# EasyEDA Pro project CT模拟器.eprj

# Schematic Schematic1
Board Name: Board1; Create Date: 2025-09-21; Page Name: P1; Project Name: 电流检测; Schematic Name: Schematic1; Update Date: 2025-09-22; Company: 嘉立创EDA; Page Size: A4; Version: V1.0
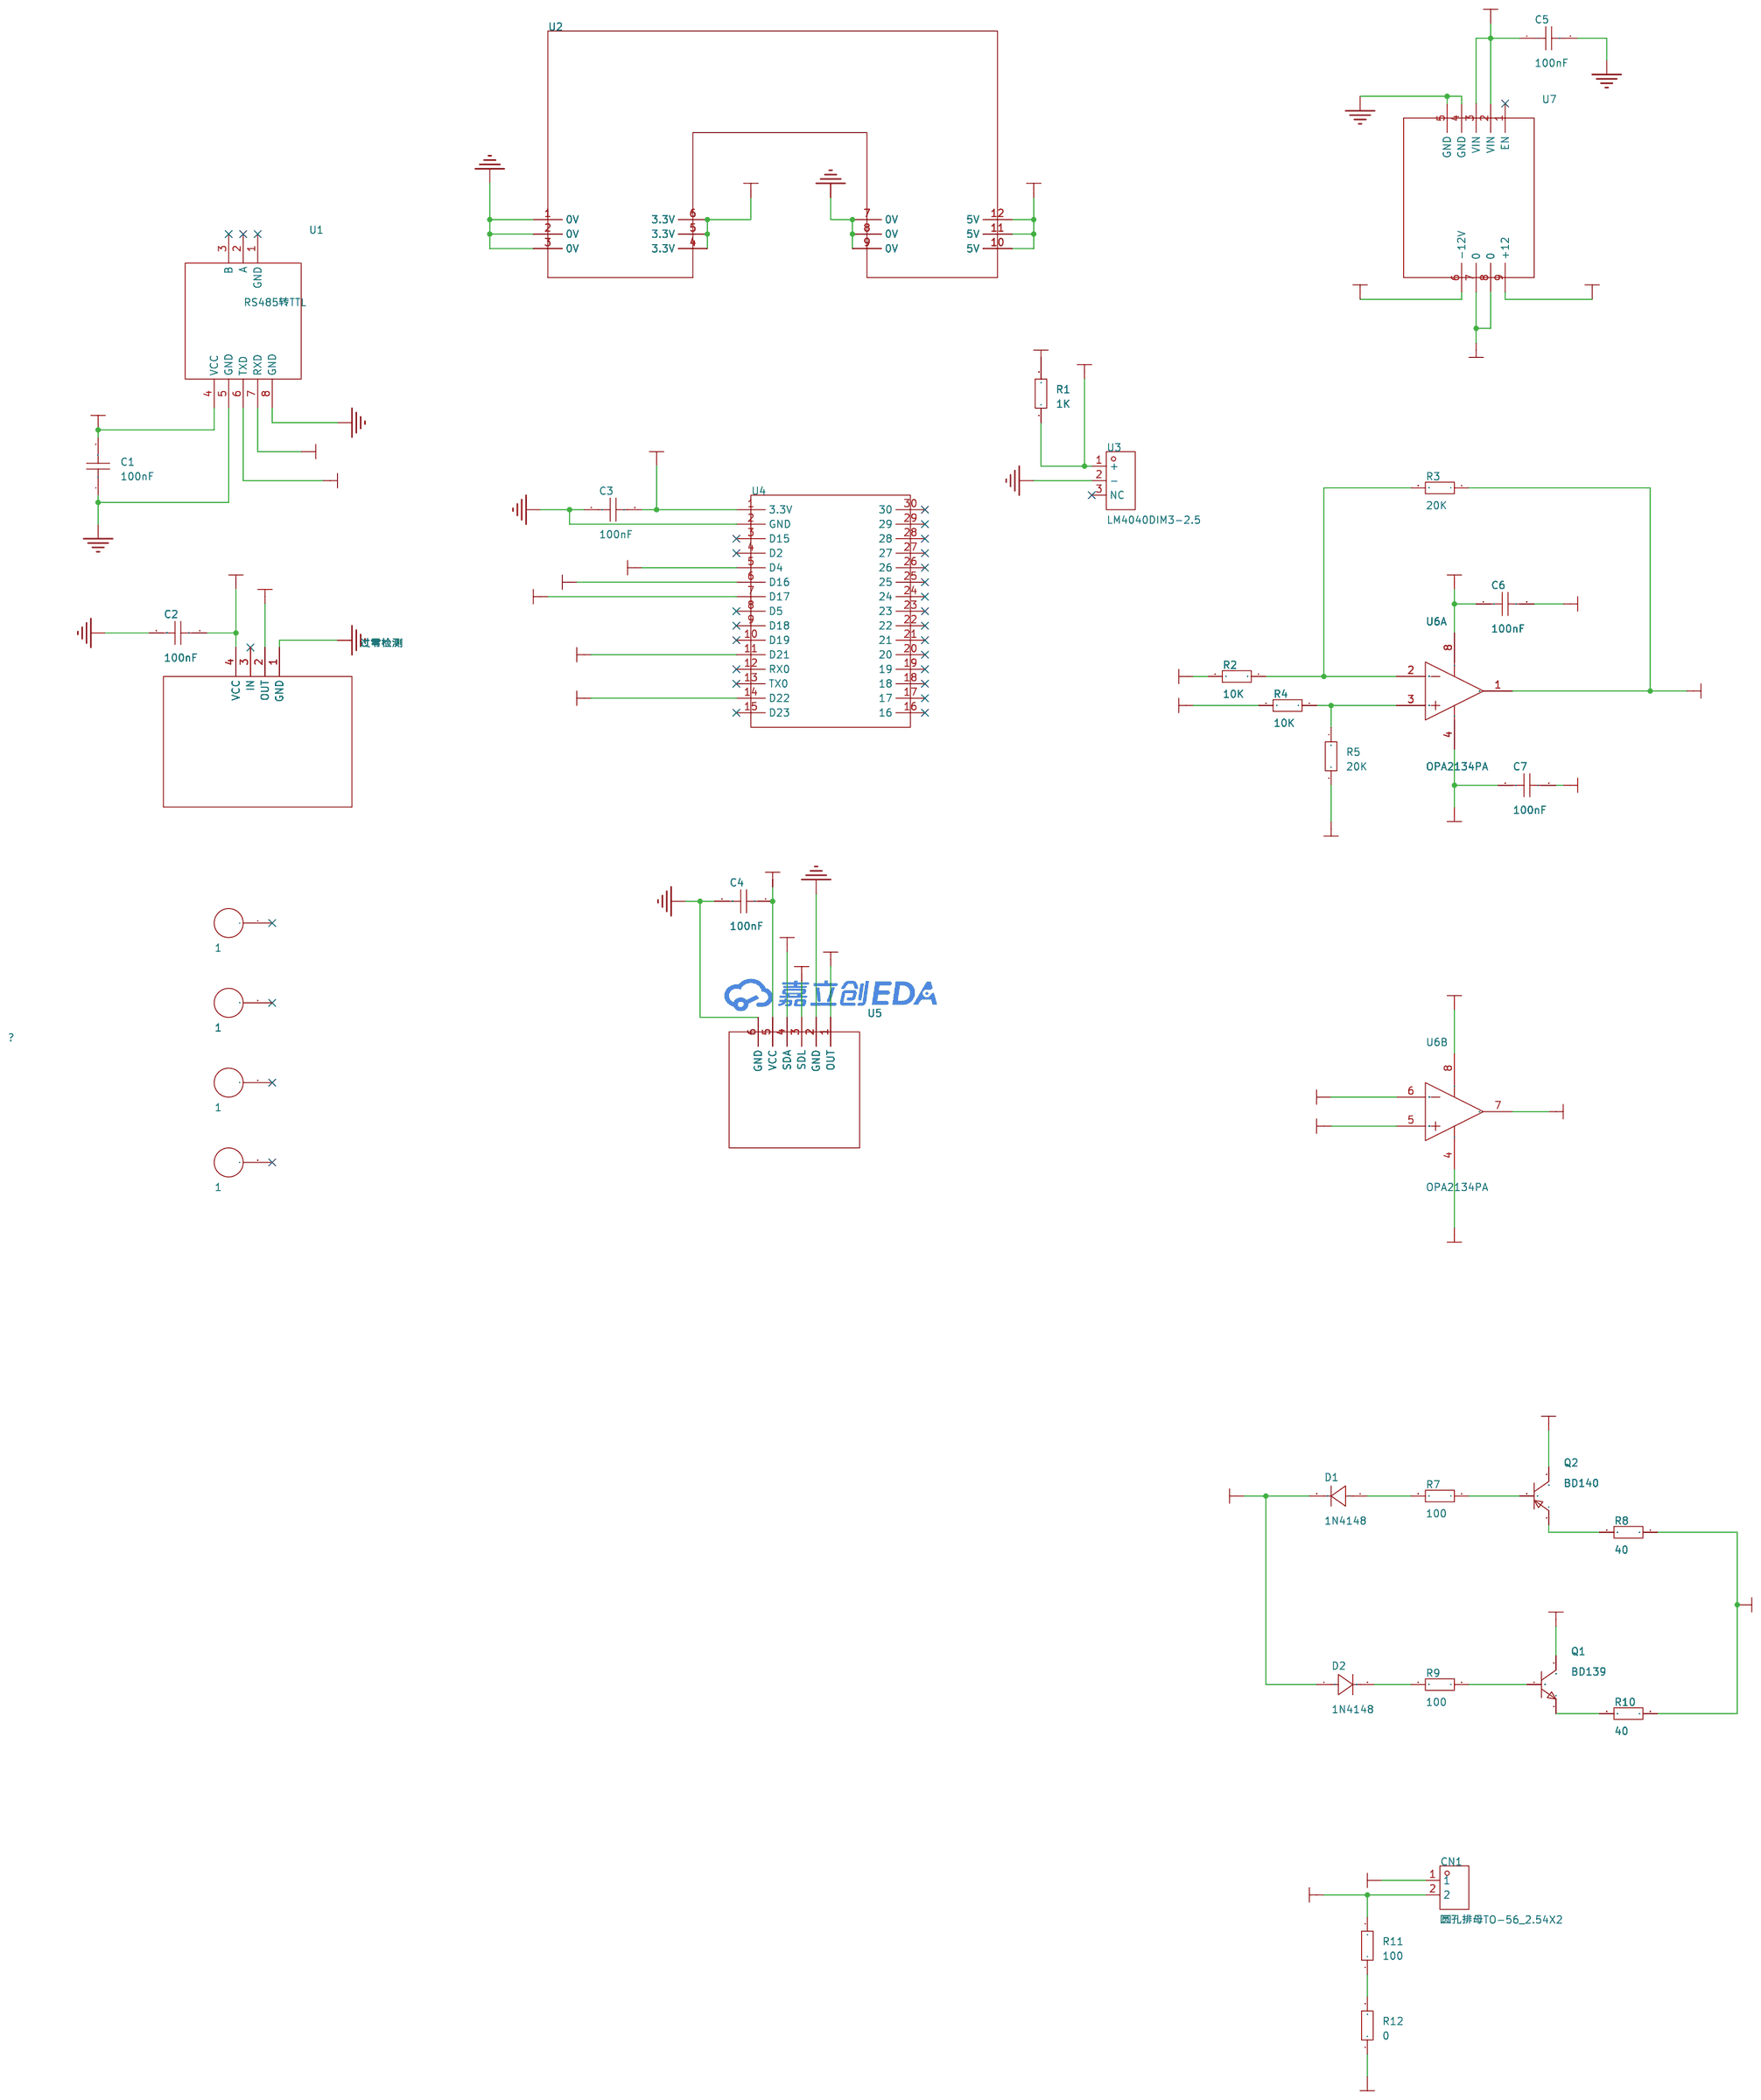
[diagram p0: schematic sheet]

## Parts
C1  100nF  [C0805]
C2  100nF  [C0805]
C3  100nF  [C0805]
C4  100nF  [C0805]
C5  100nF  [C0805]
C6  100nF  [C0805]
C7  100nF  [C0805]
CN1  圆孔排母TO-56_2.54X2  [CONN-TH_TO-56_2.54-2]
D1  1N4148  [DO-35_BD2.2-L4.0-D0.50_1N4148]
D2  1N4148  [DO-35_BD2.2-L4.0-D0.50_1N4148]
Q1  BD139  [TO-126_L7.5-W2.5-P2.3-B]
Q2  BD140  [TO-126_L8.3-W3.5-P2.29-T]
R1  1K  [R0805]
R2  10K  [R0805]
R3  20K  [R0805]
R4  10K  [R0805]
R5  20K  [R0805]
R7  100  [R0805]
R8  40  [R0805]
R9  100  [R0805]
R10  40  [R0805]
R11  100  [R0805]
R12  0  [R0805]
U1  RS485转TTL  [RS485转TTL]
U2  -  [9V1A供电]
U3  LM4040DIM3-2.5  [SOT-23-3_L2.9-W1.3-P1.90-LS2.4-BR]
U4  -  [ESP32]
U5  -  [mcp4725]
U6  OPA2134PA  [DIP-8_L9.6-W6.4-P2.54-LS7.6-BL-1]  (sections 1,2)
U7  -  [-12/+12]
V-PB2  1  [SMD_BD4.2-L4.7-W4.7-D3.0]
V-PB3  1  [SMD_BD4.2-L4.7-W4.7-D3.0]
V-PB4  1  [SMD_BD4.2-L4.7-W4.7-D3.0]
V-PB5  1  [SMD_BD4.2-L4.7-W4.7-D3.0]
过零检测  -  [过零检测]

## Library data of the parts
C1-C7 = CGA0805X6S107M4R0MT: LCSC Part Name: 100uF ±20% 4V; Supplier Part: C42371696; Manufacturer: HRE(芯声); Supplier Footprint: 0805; Datasheet: https://item.szlcsc.com/datasheet/CGA0805X6S107M4R0MT/44253246.html; Supplier: LCSC; Tolerance: ±20%; Voltage Rating: 4V; Temperature Coefficient: X6S
CN1 = 圆孔排母TO-56_2.54X2: Supplier Part: C9900002039; Supplier Footprint: TH-2_2.54X5.08X2.54P; JLCPCB Part Class: 扩展库; Supplier: LCSC
D1 D2 = 1N4148_C18195411: Supplier Part: C18195411; Manufacturer: LJ(朗捷); Supplier Footprint: DO-35; JLCPCB Part Class: 扩展库; Datasheet: https://item.szlcsc.com/datasheet/1N4148/19344798.html; Supplier: LCSC; Voltage - Forward(Vf@If): 1V@10mA; Voltage - DC Reverse(Vr): 100V; Current - Rectified: 150mA; Pd - Power Dissipation: 500mW; Reverse Leakage Current (Ir): 5mA; Reverse Recovery Time (trr): 4ns; Operating Junction Temperature Range: -60℃~+200℃; Non-Repetitive Peak Forward Surge Current: 500mA
Q1 = BD139: LCSC Part Name: NPN 电流:1.5A 电压:80V; Supplier Part: C27866; Manufacturer: ST(意法半导体); Supplier Footprint: TO-126; JLCPCB Part Class: 扩展库; Datasheet: https://item.szlcsc.com/datasheet/BD139/28616.html; Supplier: LCSC; type: NPN; Current - Collector(Ic): 1.5A; Collector - Emitter Voltage VCEO: 80V; Pd - Power Dissipation: 12.5W; DC Current Gain: 63@150mA,2V; Current - Collector Cutoff: 10uA; Vce Saturation(VCE(sat)): 500mV@0.5A,0.05A; Operating Temperature: -65℃~+150℃; Emitter-Base Voltage(Vebo): 5V; Number: 1个NPN
Q2 = BD140: LCSC Part Name: PNP 电流:1.5A 电压:80V; Supplier Part: C20604; Manufacturer: CJ(江苏长电/长晶); Supplier Footprint: TO-126; JLCPCB Part Class: 扩展库; Datasheet: https://item.szlcsc.com/datasheet/BD140/21316.html; Supplier: LCSC; type: PNP; Current - Collector(Ic): 1.5A; Collector - Emitter Voltage VCEO: 80V; Pd - Power Dissipation: 1.25W; DC Current Gain: 40@150mA,2V; Current - Collector Cutoff: 100nA; Vce Saturation(VCE(sat)): 500mV@500mA,50mA; Operating Temperature: -55℃~+150℃; Emitter-Base Voltage(Vebo): 5V; Number: 1个PNP
R1-R5 R7-R12 = 0805W8F1004T5E: LCSC Part Name: 1MΩ ±1% 125mW 厚膜电阻; Supplier Part: C17514; Manufacturer: UNI-ROYAL(厚声); Supplier Footprint: 0805; JLCPCB Part Class: 基础库; Datasheet: https://atta.szlcsc.com/upload/public/pdf/source/20200306/C422600_1E6D84923E4A46A82E41ADD87F860B5C.pdf; Supplier: LCSC; Type: 厚膜电阻; Tolerance: ±1%; Power(Watts): 125mW; Overload Voltage (Max): 150V; Temperature Coefficient: ±100ppm/℃; Operating Temperature Range: -55℃~+155℃
U1 = RS485转TTL
U2 = 9V1A供电
U3 = LM4040DIM3-2.5_C3717666: Supplier Part: C3717666; Manufacturer: TI(德州仪器); Supplier Footprint: SOT-23-3; JLCPCB Part Class: 扩展库; Datasheet: https://atta.szlcsc.com/upload/public/pdf/source/20230921/37A18546BF83911EF2A4ECD725D0B31B.pdf; Supplier: LCSC; Output Type: 固定; Output Voltage: 2.5V; Output Current: 15mA; Tolerance: ±1%; Temperature Coefficient: 150ppm/℃; Reference Type: 并联; Noise - 10Hz to 10kHz: 35uVrms; Operating Temperature: -40℃~+85℃@(Ta)
U4 = ESP32
U5 = mcp4725
U6 = OPA2134PA: Supplier Part: C1346118; Manufacturer: TI(德州仪器); Supplier Footprint: PDIP-8; JLCPCB Part Class: 扩展库; Datasheet: https://www.ti.com/cn/lit/gpn/opa2134; Supplier: LCSC; Speaker Channels: 双声道; Operating Temperature: -40℃~+85℃
U7 = -12/+12
V-PB2-V-PB5 = 铜柱M3*5+6: M3*5+6; LCSC Part Name: 国产 铜柱M3*5+6 铜柱M3*5+6; Supplier Part: C87703; Manufacturer: 国产; JLCPCB Part Class: 扩展库; Supplier: LCSC
过零检测 = 过零检测

## Nets
0V: C6.2 C7.2 R5.2 R12.1 U7.7(0) U7.8(0)
3.3V: C1.2 C2.1 C3.2 U1.4(VCC) U2.4(3.3V) U2.5(3.3V) U2.6(3.3V) U4.1(3.3V) 过零检测.4(VCC)
5V: C4.2 C5.1 R1.2 U2.10(5V) U2.11(5V) U2.12(5V) U5.5(VCC) U7.2(VIN) U7.3(VIN)
+12V: C6.1 Q1.2(C) U6.8(V+) U7.9(+12)
-12V: C7.1 Q2.2(C) U6.4(V-) U7.6(-12V)
GND: C1.1 C2.2 C3.1 C4.1 C5.2 U1.5(GND) U1.8(GND) U2.1(0V) U2.2(0V) U2.3(0V) U2.7(0V) U2.8(0V) U2.9(0V) U3.2(-) U4.2(GND) U5.2(GND) U5.6(GND) U7.4(GND) U7.5(GND) 过零检测.1(GND)
CT+: CN1.1 R8.2 R10.2
CT-: CN1.2 R11.2 U6.6(-IN B)
LM4040_2.5: R1.1 R2.2 U3.1(+)
OUT_0: U4.5(D4) 过零检测.2(OUT)
OUT_MCP4725: R4.2 U5.1(OUT)
RX: U1.7(RXD) U4.6(D16)
SDA: U4.11(D21) U5.4(SDA)
SDL: U4.14(D22) U5.3(SDL)
TX: U1.6(TXD) U4.7(D17)
VOUT1: R3.1 U6.1(OUT A) U6.5(+IN B)
VOUT2: D1.2(C) D2.1(A) U6.7(OUT B)
$1N2708: R2.1 R3.2 U6.2(-IN A)
$1N3016: R4.1 R5.1 U6.3(+IN A)
$1N3573: Q2.3(B) R7.1
$1N3578: D1.1(A) R7.2
$1N3803: D2.2(C) R9.2
$1N3806: Q1.1(B) R9.1
$1N3915: Q1.3(E) R10.1
$1N3922: Q2.1(E) R8.1
$1N11273: R11.1 R12.2

Not connected (* = marked no-connect by the designer): U1 1(GND)* 2(A)* 3(B)*; U3 3(NC)*; U4 3(D15)* 4(D2)* 8(D5)* 9(D18)* 10(D19)* 12(RX0)* 13(TX0)* 15(D23)* 16* 17* 18* 19* 20* 21* 22* 23* 24* 25* 26* 27* 28* 29* 30*; U7 1(EN)*; V-PB2 1*; V-PB3 1*; V-PB4 1*; V-PB5 1*; 过零检测 3(IN)*

# Board PCB1
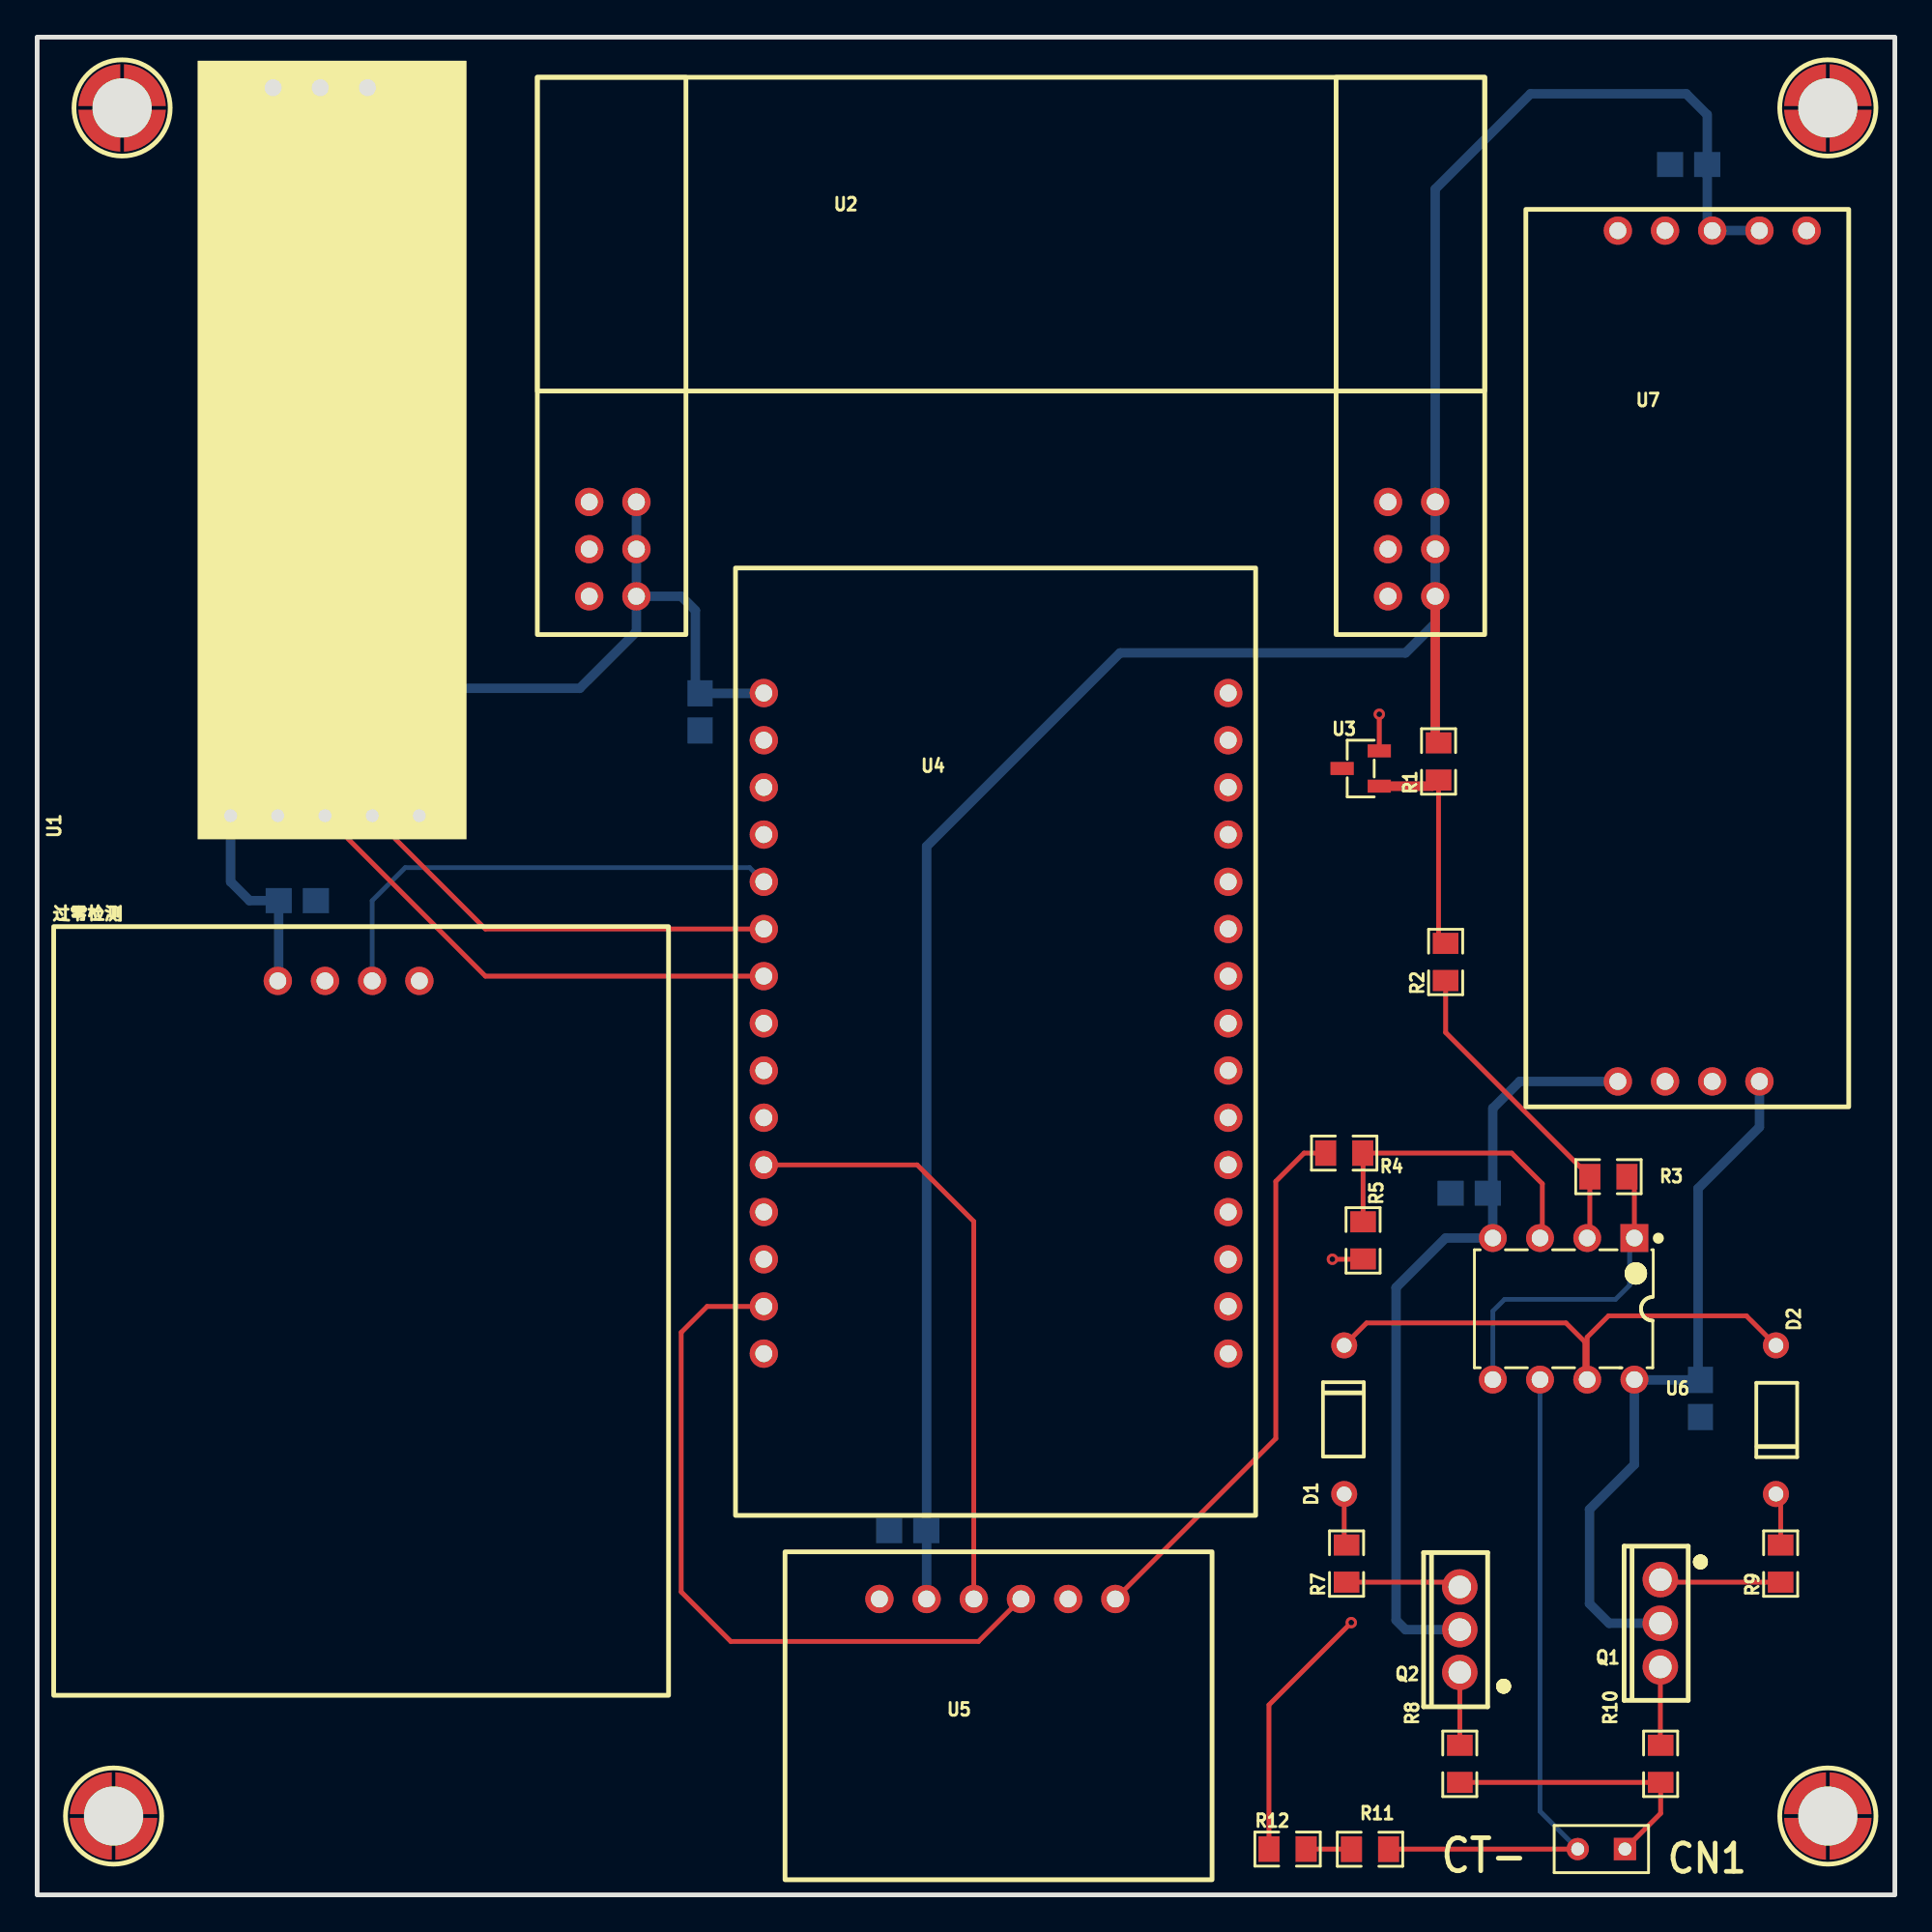
[diagram p1: board, top side]
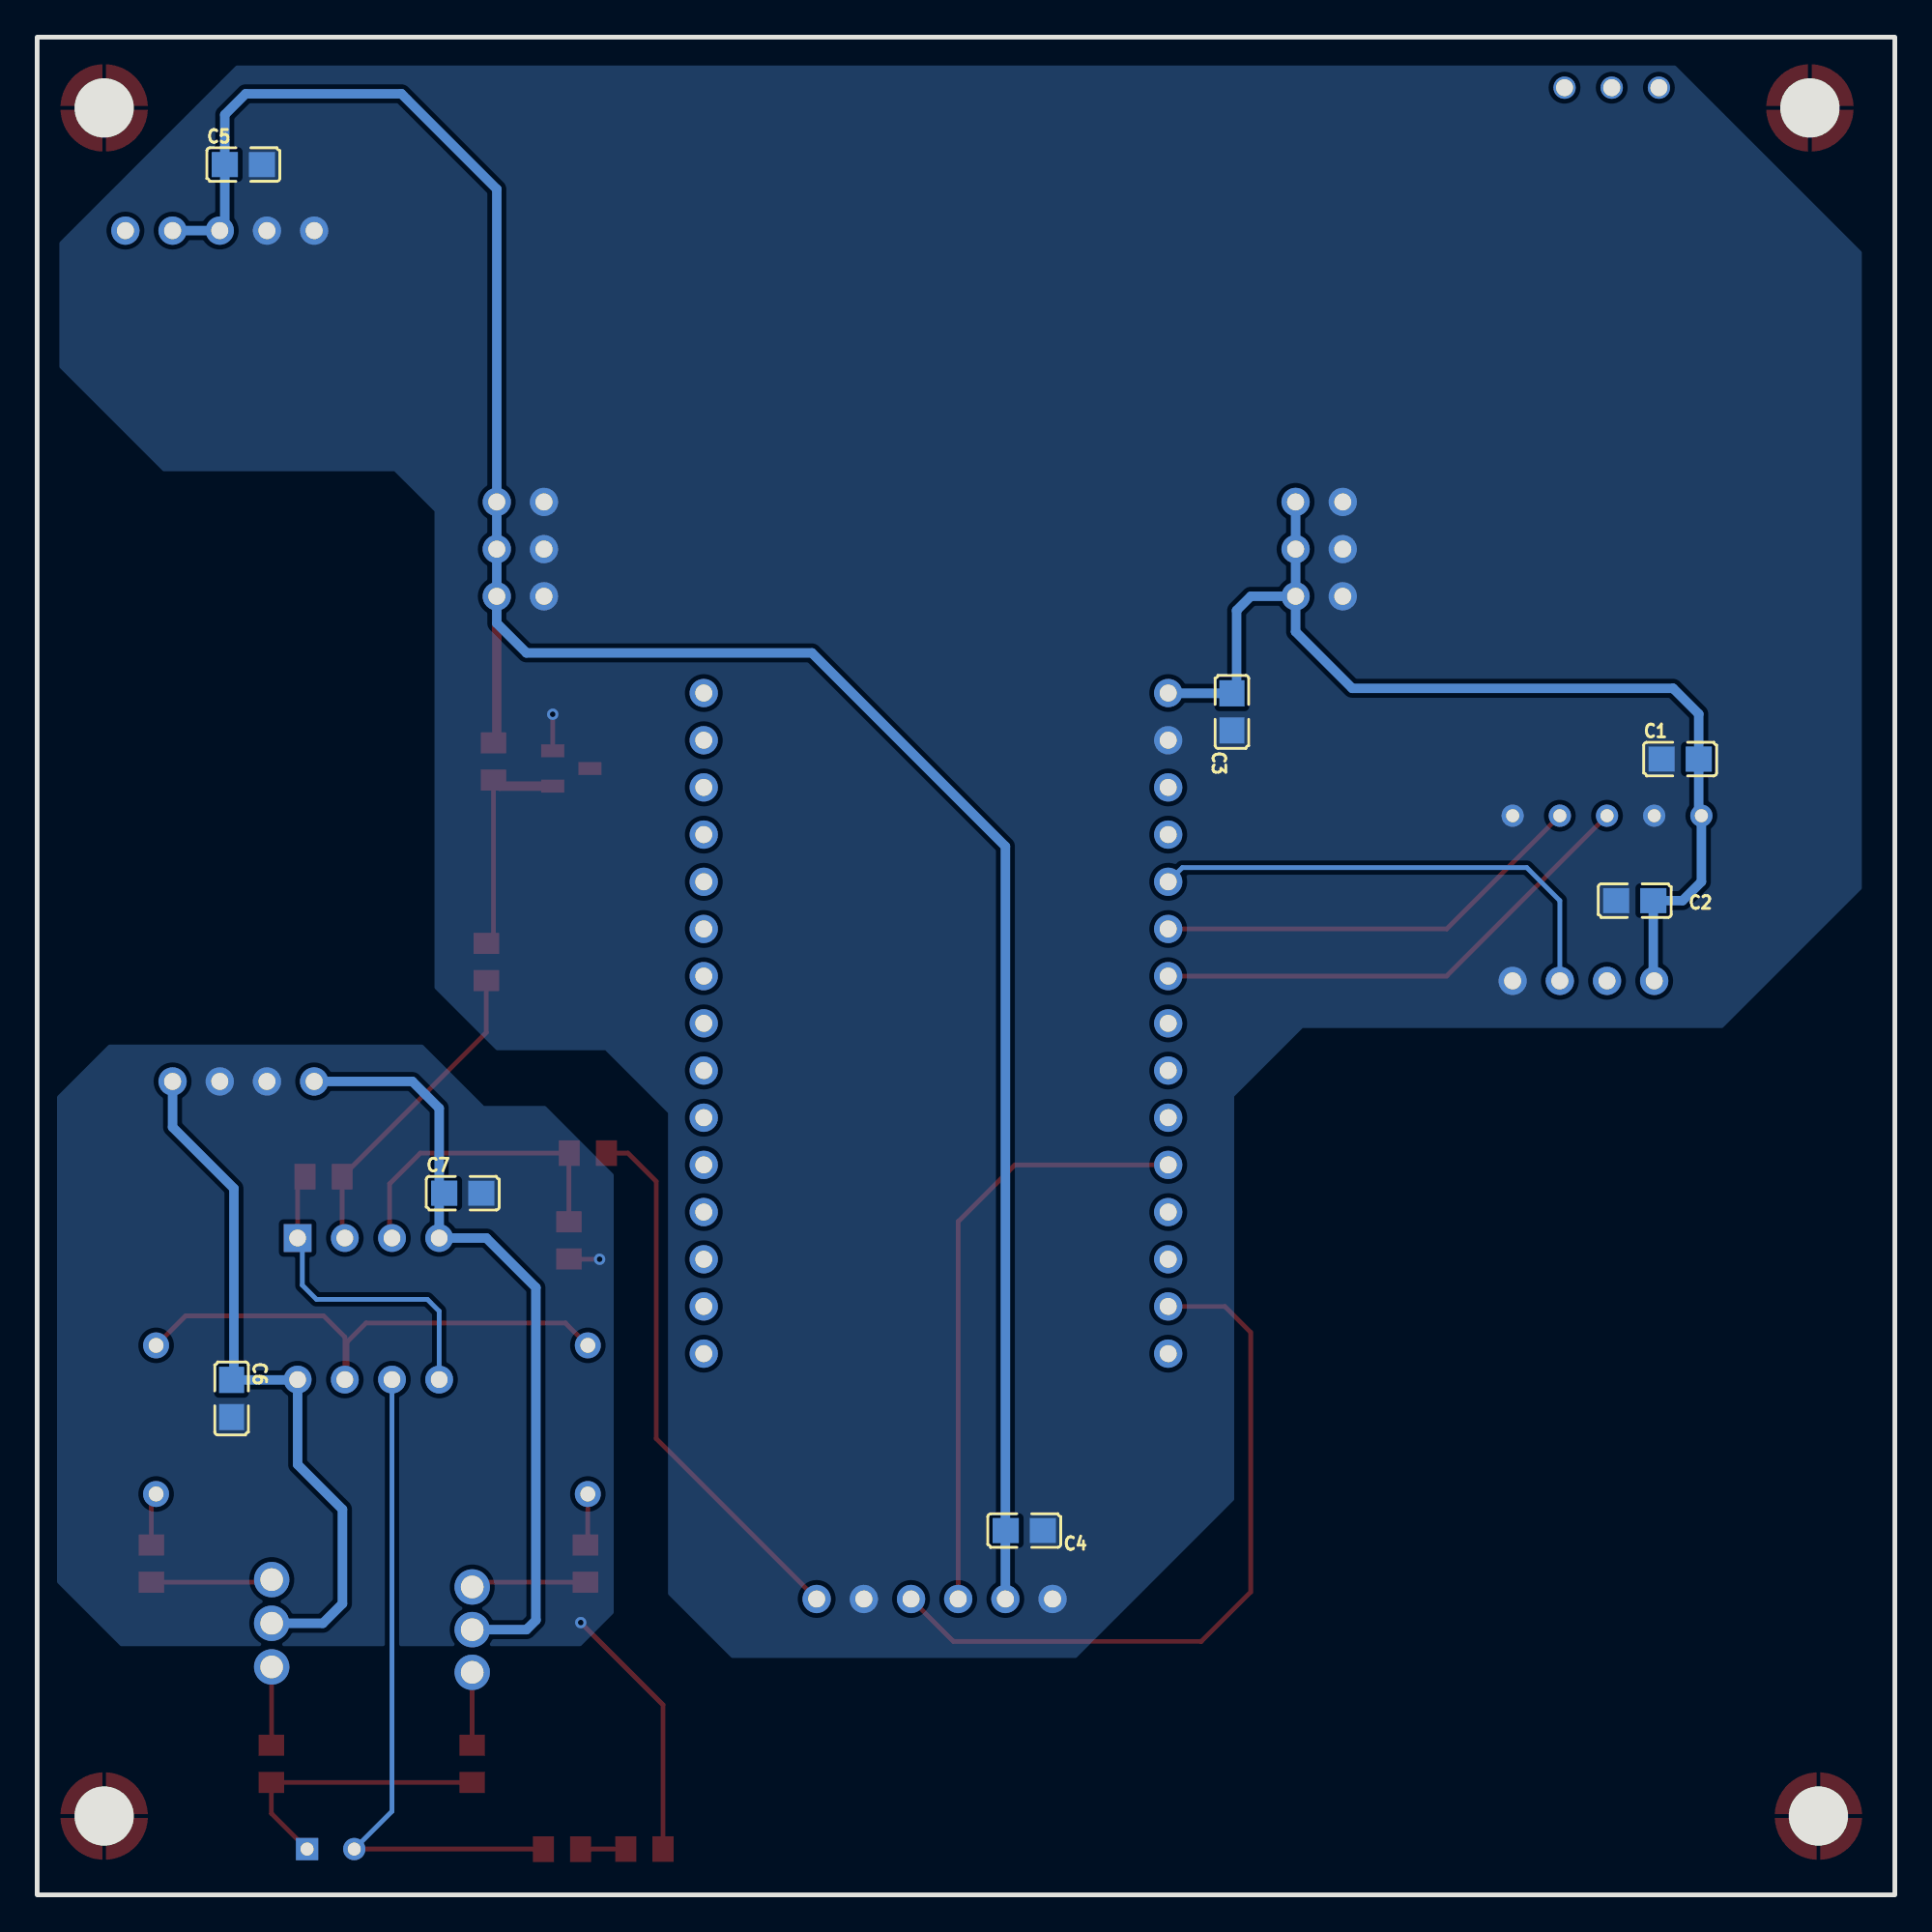
[diagram p2: board, bottom side, seen from below]

Outline 100 x 100 mm; copper layers: Top Layer, Bottom Layer. Coordinates in mm from the lower left corner of the outline.
Outline path: rectangle 0,100 100,0
Stack: Top Layer 0.035mm / Dielectric1 1.51mm FR4 er 4.5 / Bottom Layer 0.035mm

## Design rules (mm)
template: 自定义配置
spacing copperThickness1oz (default): track to track 0.102, other pairs 0.152 to 0.3
spacing copperThickness2oz: track to track 0.203, other pairs 0.152 to 0.3
track width copperThickness1oz (default): min 0.127, default 0.254, max 2.54
track width copperThickness2oz: min 0.203, default 0.254, max 2.54
differential pair differentialPair (default): width min 0.127, default 0.254, max 2.54; gap min 0.152, default 0.152
via viaSize (default): diameter min 0.5, default 0.61, max 10; hole min 0.3, default 0.305, max 6.3

## Placement (name value [footprint] x y rotation side)
C1  100nF  [C0805]  11.56 61.14 180 bottom
C2  100nF  [C0805]  14 53.52 0 bottom
C3  100nF  [C0805]  35.69 63.68 90 bottom
C4  100nF  [C0805]  46.86 19.61 0 bottom
C5  100nF  [C0805]  88.9 93.14 180 bottom
C6  100nF  [C0805]  89.53 26.72 270 bottom
C7  100nF  [C0805]  77.09 37.77 180 bottom
CN1  圆孔排母TO-56_2.54X2  [CONN-TH_TO-56_2.54-2]  84.2 2.46 180 top
D1  1N4148  [DO-35_BD2.2-L4.0-D0.50_1N4148]  70.36 25.58 90 top
D2  1N4148  [DO-35_BD2.2-L4.0-D0.50_1N4148]  93.6 25.58 270 top
Q1  BD139  [TO-126_L7.5-W2.5-P2.3-B]  87.38 14.62 180 top
Q2  BD140  [TO-126_L8.3-W3.5-P2.29-T]  76.58 14.28 180 top
R1  1K  [R0805]  75.44 61.01 90 top
R2  10K  [R0805]  75.82 50.22 90 top
R3  20K  [R0805]  84.58 38.66 180 top
R4  10K  [R0805]  70.36 39.93 180 top
R5  20K  [R0805]  71.37 35.23 270 top
R7  100  [R0805]  70.48 17.83 90 top
R8  40  [R0805]  76.58 7.05 270 top
R9  100  [R0805]  93.85 17.83 90 top
R10  40  [R0805]  87.39 7.05 270 top
R11  100  [R0805]  71.75 2.46 0 top
R12  0  [R0805]  67.31 2.46 0 top
U1  -  [RS485转TTL]  16 76.51 90 top
U2  -  [9V1A供电]  29.72 74.98 0 top
U3  LM4040DIM3-2.5  [SOT-23-3_L2.9-W1.3-P1.90-LS2.4-BR]  71.25 60.63 0 top
U4  -  [ESP32]  38.99 67.36 0 top
U5  -  [mcp4725]  42.8 15.93 0 top
U6  OPA2134PA  [DIP-8_L9.6-W6.4-P2.54-LS7.6-BL-1]  82.17 31.55 180 top
U7  -  [-12/+12]  85.09 89.59 0 top
V-PB2  1  [SMD_BD4.2-L4.7-W4.7-D3.0]  96.39 96.19 0 top
V-PB3  1  [SMD_BD4.2-L4.7-W4.7-D3.0]  4.57 96.19 0 top
V-PB4  1  [SMD_BD4.2-L4.7-W4.7-D3.0]  96.39 4.24 0 top
V-PB5  1  [SMD_BD4.2-L4.7-W4.7-D3.0]  4.11 4.24 0 top
过零检测  -  [过零检测]  12.95 49.2 0 top

## Footprints (pads in the part's own frame, mm; a bottom-side part is the same pattern mirrored in y, then rotated)
9V1A供电
  round 1.524 hole 0.914: 1(0,0) 2(0,-2.54) 3(0,-5.08) 4(2.54,-5.08) 5(2.54,-2.54) 6(2.54,0) 7(43,0) 8(43,-2.54) 9(43,-5.08) 10(45.54,-5.08) 11(45.54,-2.54) 12(45.54,0)
-12/+12
  round 1.524 hole 0.914: 1(10.16,0) 2(7.62,0) 3(5.08,0) 4(2.54,0) 5(0,0) 6(0,-45.8) 7(2.54,-45.8) 8(5.08,-45.8) 9(7.62,-45.8)
C0805
  rect 1.41x1.35 smd: 1(-1,0) 2(1,0)
CONN-TH_TO-56_2.54-2
  rect 1.2x1.2 hole 0.7: 1(-1.27,0)
  round 1.2 hole 0.7: 2(1.27,0)
DIP-8_L9.6-W6.4-P2.54-LS7.6-BL-1
  rect 1.5x1.5 hole 0.9: 1(-3.81,-3.81)
  round 1.5 hole 0.9: 2(-1.27,-3.81) 3(1.27,-3.81) 4(3.81,-3.81) 5(3.81,3.81) 6(1.27,3.81) 7(-1.27,3.81) 8(-3.81,3.81)
DO-35_BD2.2-L4.0-D0.50_1N4148
  round 1.4 hole 0.8: 1(-4,0) 2(4,0)
ESP32
  round 1.524 hole 0.914: 1(0.127,-2.667) 2(0.127,-5.207) 3(0.127,-7.747) 4(0.127,-10.287) 5(0.127,-12.827) 6(0.127,-15.367) 7(0.127,-17.907) 8(0.127,-20.447) 9(0.127,-22.987) 10(0.127,-25.527) 11(0.127,-28.067) 12(0.127,-30.607) 13(0.127,-33.147) 14(0.127,-35.687) 15(0.127,-38.227) 16(25.127,-38.227) 17(25.127,-35.687) 18(25.127,-33.147) 19(25.127,-30.607) 20(25.127,-28.067) 21(25.127,-25.527) 22(25.127,-22.987) 23(25.127,-20.447) 24(25.127,-17.907) 25(25.127,-15.367) 26(25.127,-12.827) 27(25.127,-10.287) 28(25.127,-7.747) 29(25.127,-5.207) 30(25.127,-2.667)
mcp4725
  round 1.524 hole 0.914: 1(15.24,0) 2(12.7,0) 3(10.16,0) 4(7.62,0) 5(5.08,0) 6(2.54,0)
R0805
  rect 1.133x1.377 smd: 1(-1,0) 2(1,0)
RS485转TTL
  round 1.199 hole 0.914x0.701: 1(20.775,-1.778) 2(20.775,0.762) 3(20.775,3.302)
  round 1.199 hole 0.701: 4(-18.415,5.588) 5(-18.415,3.048) 6(-18.415,0.508) 7(-18.415,-2.032) 8(-18.415,-4.572)
SMD_BD4.2-L4.7-W4.7-D3.0
  custom 2.25x2.25 smd: 1(-1.225,1.443) 1(-1.225,-1.442) 1(1.225,1.443) 1(1.225,-1.443)
SOT-23-3_L2.9-W1.3-P1.90-LS2.4-BR
  rect 1.25x0.7 smd: 1(1,-0.95) 2(1,0.95) 3(-1,0)
TO-126_L7.5-W2.5-P2.3-B
  round 1.905 hole 1.219: 1(0,-2.35) 2(0,0) 3(0,2.35)
TO-126_L8.3-W3.5-P2.29-T
  round 1.905 hole 1.219: 1(0,2.299) 2(0,0) 3(0,-2.299)
过零检测
  round 1.524 hole 0.914: 1(7.62,0) 2(5.08,0) 3(2.54,0) 4(0,0)

## Nets
As in the schematic.

Pads without a net: U1 1 2 3; U3 3; U4 3 4 8 9 10 12 13 15 16 17 18 19 20 21 22 23 24 25 26 27 28 29 30; U7 1; V-PB2 1; V-PB3 1; V-PB4 1; V-PB5 1; 过零检测 3

## Via types
v1: diameter 0.61, hole 0.305, Top Layer to Bottom Layer, 3 vias

## Routing (per net, layer and track width the routed paths; a pad name or vN(x,y) marks a point on that pad's centre or on a via; arc(x,y) is an arc through that point)
0V: length 15.7
  Top Layer w0.254: R5.2 71.36,34.21 v1(69.72,34.21) ; v1(70.74,14.66) 66.31,10.23 R12.1
3.3V: length 58.5
  Bottom Layer w0.508: U4.1 39.1,64.68 C3.2 35.43,64.93 35.43,69.14 34.67,69.9 U2.4 ; U2.4 32.26,68 29.21,64.95 11.94,64.95 10.56,63.57 C1.2 10.56,58.23 U1.4 10.41,54.53 11.43,53.52 C2.1 13,49.25 过零检测.4 ; U2.4 U2.6
5V: length 130.6
  Top Layer w0.508: U2.10 75.26,62.32 75.69,61.88
  Bottom Layer w0.508: U7.2 U7.3 89.9,89.86 C5.1 89.9,95.83 88.77,96.95 80.39,96.95 75.26,91.82 U2.12 U2.10 75.26,68.45 73.66,66.85 58.29,66.85 47.88,56.44 U5.5
+12V: length 38.5
  Bottom Layer w0.508: 86.36,27.72 85.98,27.34 85.98,23.17 83.57,20.75 83.57,15.67 84.62,14.62 Q1.2 ; 86.36,27.72 86.36,27.74 86.11,27.99 ; 86.36,27.72 C6.1 89.41,27.85 89.41,38.02 92.71,41.33 U7.9
-12V: length 42.2
  Bottom Layer w0.508: U7.6 79.8,43.79 78.36,42.34 U6.4 75.82,35.36 73.15,32.69 73.15,14.78 73.66,14.28 Q2.2
GND: length 2
  Top Layer w0.254: U3.2 v1(72.25,63.55)
CT+: length 15.2
  Top Layer w0.254: R8.2 R10.2 87.39,4.39 CN1.1
CT-: length 36.3
  Top Layer w0.254: R11.2 72.76,2.46 CN1.2
  Bottom Layer w0.254: CN1.2 80.9,4.5 U6.6
LM4040_2.5: length 12.3
  Top Layer w0.254: R1.1 75.44,51.6 R2.2
  Top Layer w0.508: R1.1 75.11,59.68 U3.1
OUT_0: length 26.5
  Bottom Layer w0.254: U4.5 38.35,55.3 19.81,55.3 18.03,53.52 过零检测.2
OUT_MCP4725: length 29.4
  Top Layer w0.254: R4.2 68.2,39.93 66.67,38.41 66.67,24.56 U5.1
RX: length 23.6
  Top Layer w0.254: U4.6 24.13,51.99 U1.7
SDA: length 32.9
  Top Layer w0.254: U4.11 47.37,39.29 50.42,36.25 U5.4
SDL: length 39.3
  Top Layer w0.254: U5.3 50.67,13.64 37.34,13.64 34.67,16.31 34.67,30.28 36.07,31.67 U4.14
TX: length 27.2
  Top Layer w0.254: U4.7 24.13,49.45 U1.6
VOUT1: length 17.7
  Top Layer w0.254: R3.1 85.98,38.26 U6.1
  Bottom Layer w0.254: U6.1 85.73,35.1 85.73,32.82 84.96,32.06 78.99,32.06 78.36,31.42 U6.5
VOUT2: length 29.5
  Top Layer w0.254: D2.1 92.01,31.17 84.58,31.17 83.44,30.02 U6.7 83.31,27.86 83.31,29.77 82.3,30.79 71.56,30.79 D1.2
$1N2708: length 17.1
  Top Layer w0.254: R2.1 75.82,46.42 R3.2 83.58,35.5 U6.2
$1N3016: length 17
  Top Layer w0.254: R5.1 71.37,39.91 R4.1 79.37,39.93 81.03,38.28 81.03,35.48 U6.3
$1N3573: length 6.2
  Top Layer w0.254: Q2.3 76.32,16.83 R7.1
$1N3578: length 2.8
  Top Layer w0.254: D1.1 70.36,18.96 R7.2
$1N3803: length 2.9
  Top Layer w0.254: R9.2 93.85,21.32 D2.2
$1N3806: length 6.5
  Top Layer w0.254: R9.1 87.51,16.83 87.38,16.97
$1N3915: length 4.2
  Top Layer w0.254: R10.1 87.38,8.07 Q1.3
$1N3922: length 3.9
  Top Layer w0.254: Q2.1 R8.1
$1N11273: length 2.4
  Top Layer w0.254: R11.1 70.74,2.46 R12.2

## Copper pours and planes (outline as drawn; the poured copper is in the pictures)
0V on Bottom Layer: 79.25,45.77 96.14,45.77 98.93,42.98 98.93,16.81 95.5,13.39 70.74,13.39 68.96,15.16 68.96,38.79 72.64,42.47 75.95,42.47
GND on Bottom Layer: 1.78,88.44 11.81,98.48 89.28,98.48 98.81,88.95 98.81,82.22 93.22,76.63 80.77,76.63 78.61,74.47 78.61,48.8 75.28,45.46 69.42,45.46 66.04,42.09 66.04,16.18 62.61,12.75 44.07,12.75 35.56,21.26 35.56,42.98 31.88,46.66 9.27,46.66 1.78,54.15

## Text on the board
Top Silkscreen Layer: CT-
